# EAGLE design Octopus_USB_CAN_V1_1 (EAGLE 5.11)
FARNELL: 1712841; MF: AVX; MPN: 08055C104KAT2A; OC_FARNELL: 499687

## Sheet 1 of 2
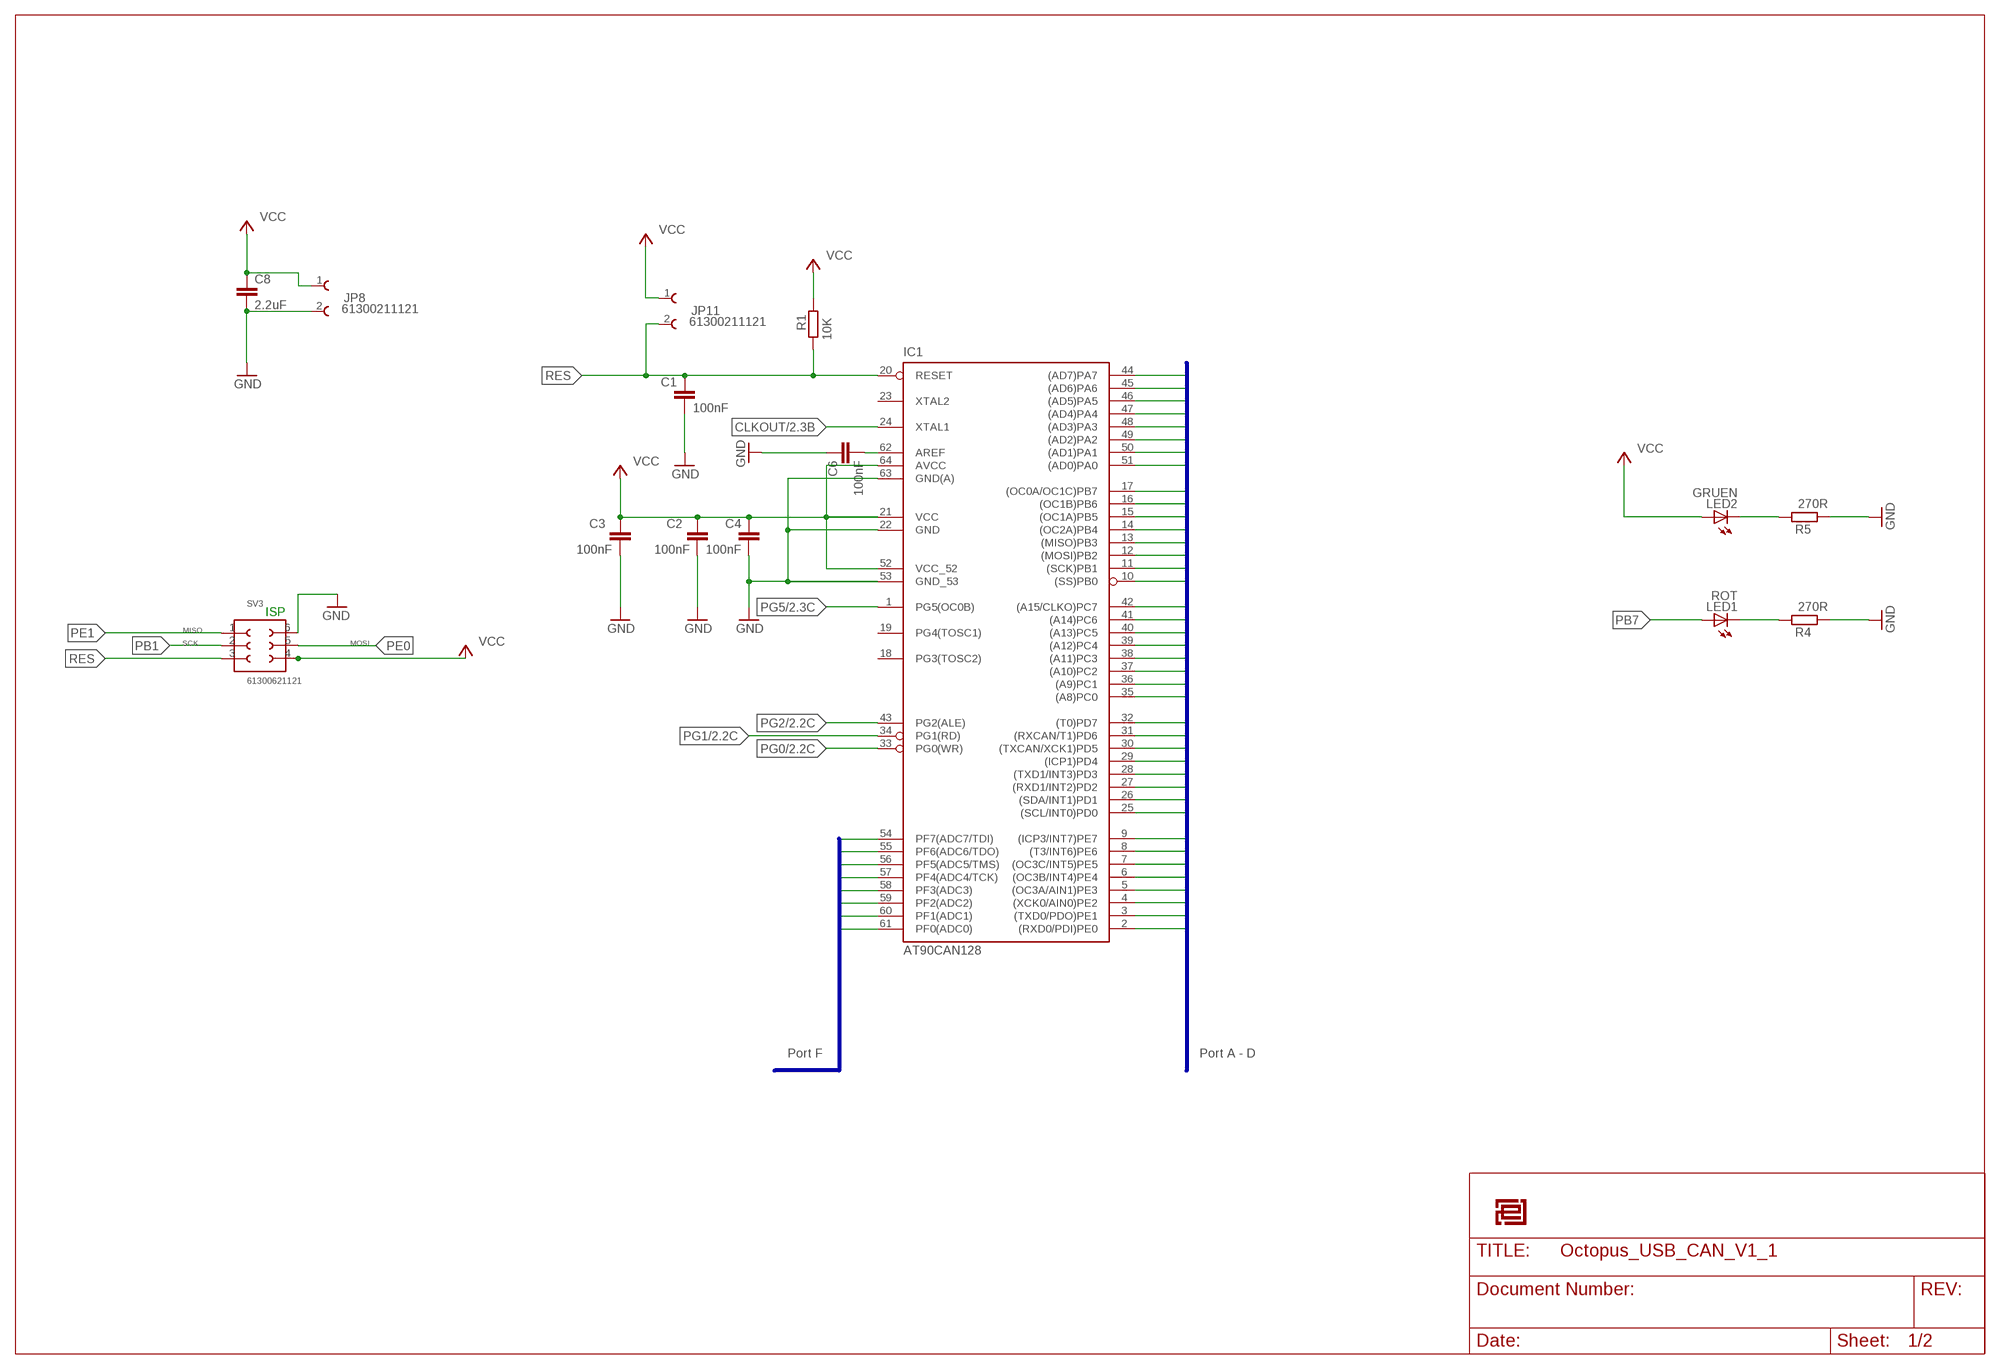
[diagram p0: schematic, sheet 1]

### Parts
C1  100nF  C-EUC0805  [C0805]
C2  100nF  C-EUC0805  [C0805]
C3  100nF  C-EUC0805  [C0805]
C4  100nF  C-EUC0805  [C0805]
C6  100nF  C-EUC0805  [C0805]
C8  2.2uF  C-EUC0805  [C0805]
IC1  AT90CAN128  [TQFP64]
JP8  61300211121  [61300211121]
JP11  61300211121  [61300211121]
LED1  ROT  LEDCHIP-LED0805  [CHIP-LED0805]
LED2  GRUEN  LEDCHIP-LED0805  [CHIP-LED0805]
R1  10K  R-EU_R0805  [R0805]
R4  270R  R-EU_R0805  [R0805]
R5  270R  R-EU_R0805  [R0805]
SV3  61300621121  [61300621121]
U$1  EPLOGO  [EPLOGOKUPFER]

### Nets
CLKOUT: IC1.24(XTAL1) ; also sheet 2
GND: C1.1 C2.2 C3.1 C4.1 C6.2 C8.2 IC1.22(GND) IC1.53(GND_53) IC1.63(GND(A)) JP8.2 R4.2 R5.2 SV3.6 ; also sheet 2
N$1: C6.1 IC1.62(AREF)
N$4: LED1.C R4.1
N$5: LED2.C R5.1
PA0: IC1.51((AD0)PA0) ; also sheet 2
PA1: IC1.50((AD1)PA1) ; also sheet 2
PA2: IC1.49((AD2)PA2) ; also sheet 2
PA3: IC1.48((AD3)PA3) ; also sheet 2
PA4: IC1.47((AD4)PA4) ; also sheet 2
PA5: IC1.46((AD5)PA5) ; also sheet 2
PA6: IC1.45((AD6)PA6) ; also sheet 2
PA7: IC1.44((AD7)PA7) ; also sheet 2
PB0: IC1.10((SS)PB0) ; also sheet 2
PB1: IC1.11((SCK)PB1) SV3.2 ; also sheet 2
PB2: IC1.12((MOSI)PB2) ; also sheet 2
PB3: IC1.13((MISO)PB3) ; also sheet 2
PB4: IC1.14((OC2A)PB4) ; also sheet 2
PB5: IC1.15((OC1A)PB5) ; also sheet 2
PB6: IC1.16((OC1B)PB6) ; also sheet 2
PB7: IC1.17((OC0A/OC1C)PB7) LED1.A ; also sheet 2
PC0: IC1.35((A8)PC0) ; also sheet 2
PC1: IC1.36((A9)PC1) ; also sheet 2
PC2: IC1.37((A10)PC2) ; also sheet 2
PC3: IC1.38((A11)PC3) ; also sheet 2
PC4: IC1.39((A12)PC4) ; also sheet 2
PC5: IC1.40((A13)PC5) ; also sheet 2
PC6: IC1.41((A14)PC6) ; also sheet 2
PC7: IC1.42((A15/CLKO)PC7) ; also sheet 2
PD0: IC1.25((SCL/INT0)PD0) ; also sheet 2
PD1: IC1.26((SDA/INT1)PD1) ; also sheet 2
PD2: IC1.27((RXD1/INT2)PD2) ; also sheet 2
PD3: IC1.28((TXD1/INT3)PD3) ; also sheet 2
PD4: IC1.29((ICP1)PD4) ; also sheet 2
PD5: IC1.30((TXCAN/XCK1)PD5) ; also sheet 2
PD6: IC1.31((RXCAN/T1)PD6) ; also sheet 2
PD7: IC1.32((T0)PD7) ; also sheet 2
PE0: IC1.2((RXD0/PDI)PE0) SV3.5 ; also sheet 2
PE1: IC1.3((TXD0/PDO)PE1) SV3.1 ; also sheet 2
PE2: IC1.4((XCK0/AIN0)PE2) ; also sheet 2
PE3: IC1.5((OC3A/AIN1)PE3) ; also sheet 2
PE4: IC1.6((OC3B/INT4)PE4) ; also sheet 2
PE5: IC1.7((OC3C/INT5)PE5) ; also sheet 2
PE6: IC1.8((T3/INT6)PE6) ; also sheet 2
PE7: IC1.9((ICP3/INT7)PE7) ; also sheet 2
PF0: IC1.61(PF0(ADC0)) ; also sheet 2
PF1: IC1.60(PF1(ADC1)) ; also sheet 2
PF2: IC1.59(PF2(ADC2)) ; also sheet 2
PF3: IC1.58(PF3(ADC3)) ; also sheet 2
PF4: IC1.57(PF4(ADC4/TCK)) ; also sheet 2
PF5: IC1.56(PF5(ADC5/TMS)) ; also sheet 2
PF6: IC1.55(PF6(ADC6/TDO)) ; also sheet 2
PF7: IC1.54(PF7(ADC7/TDI)) ; also sheet 2
PG0: IC1.33(PG0(WR)) ; also sheet 2
PG1: IC1.34(PG1(RD)) ; also sheet 2
PG2: IC1.43(PG2(ALE)) ; also sheet 2
PG5: IC1.1(PG5(OC0B)) ; also sheet 2
RES: C1.2 IC1.20(RESET) JP11.2 R1.2 SV3.3
VCC [500mA]: C2.1 C3.2 C4.2 C8.1 IC1.21(VCC) IC1.52(VCC_52) IC1.64(AVCC) JP8.1 JP11.1 LED2.A R1.1 SV3.4 ; also sheet 2
Unconnected: IC1.18(PG3(TOSC2)) IC1.19(PG4(TOSC1)) IC1.23(XTAL2)

### Buses
PF0,PF1,PF2,PF3,PF4,PF5,PF6,PF7
PA0,PA1,PA2,PA3,PA4,PA5,PA6,PA7,PB0,PB1,PB2,PB3,PB4,PB5,PB6,PB7,PC0,PC1,PC2,PC3,PC4,PC5,PC6,PC7,PD0,PD1,PD2,PD3,PD4,PD5,PD6,PD7,PE0,PE1,PE2,PE3,PE4,PE5,PE6,PE7

### Notes on the sheet
- ISP
- MISO
- SCK | MOSI
- Port F | Port A - D

## Sheet 2 of 2
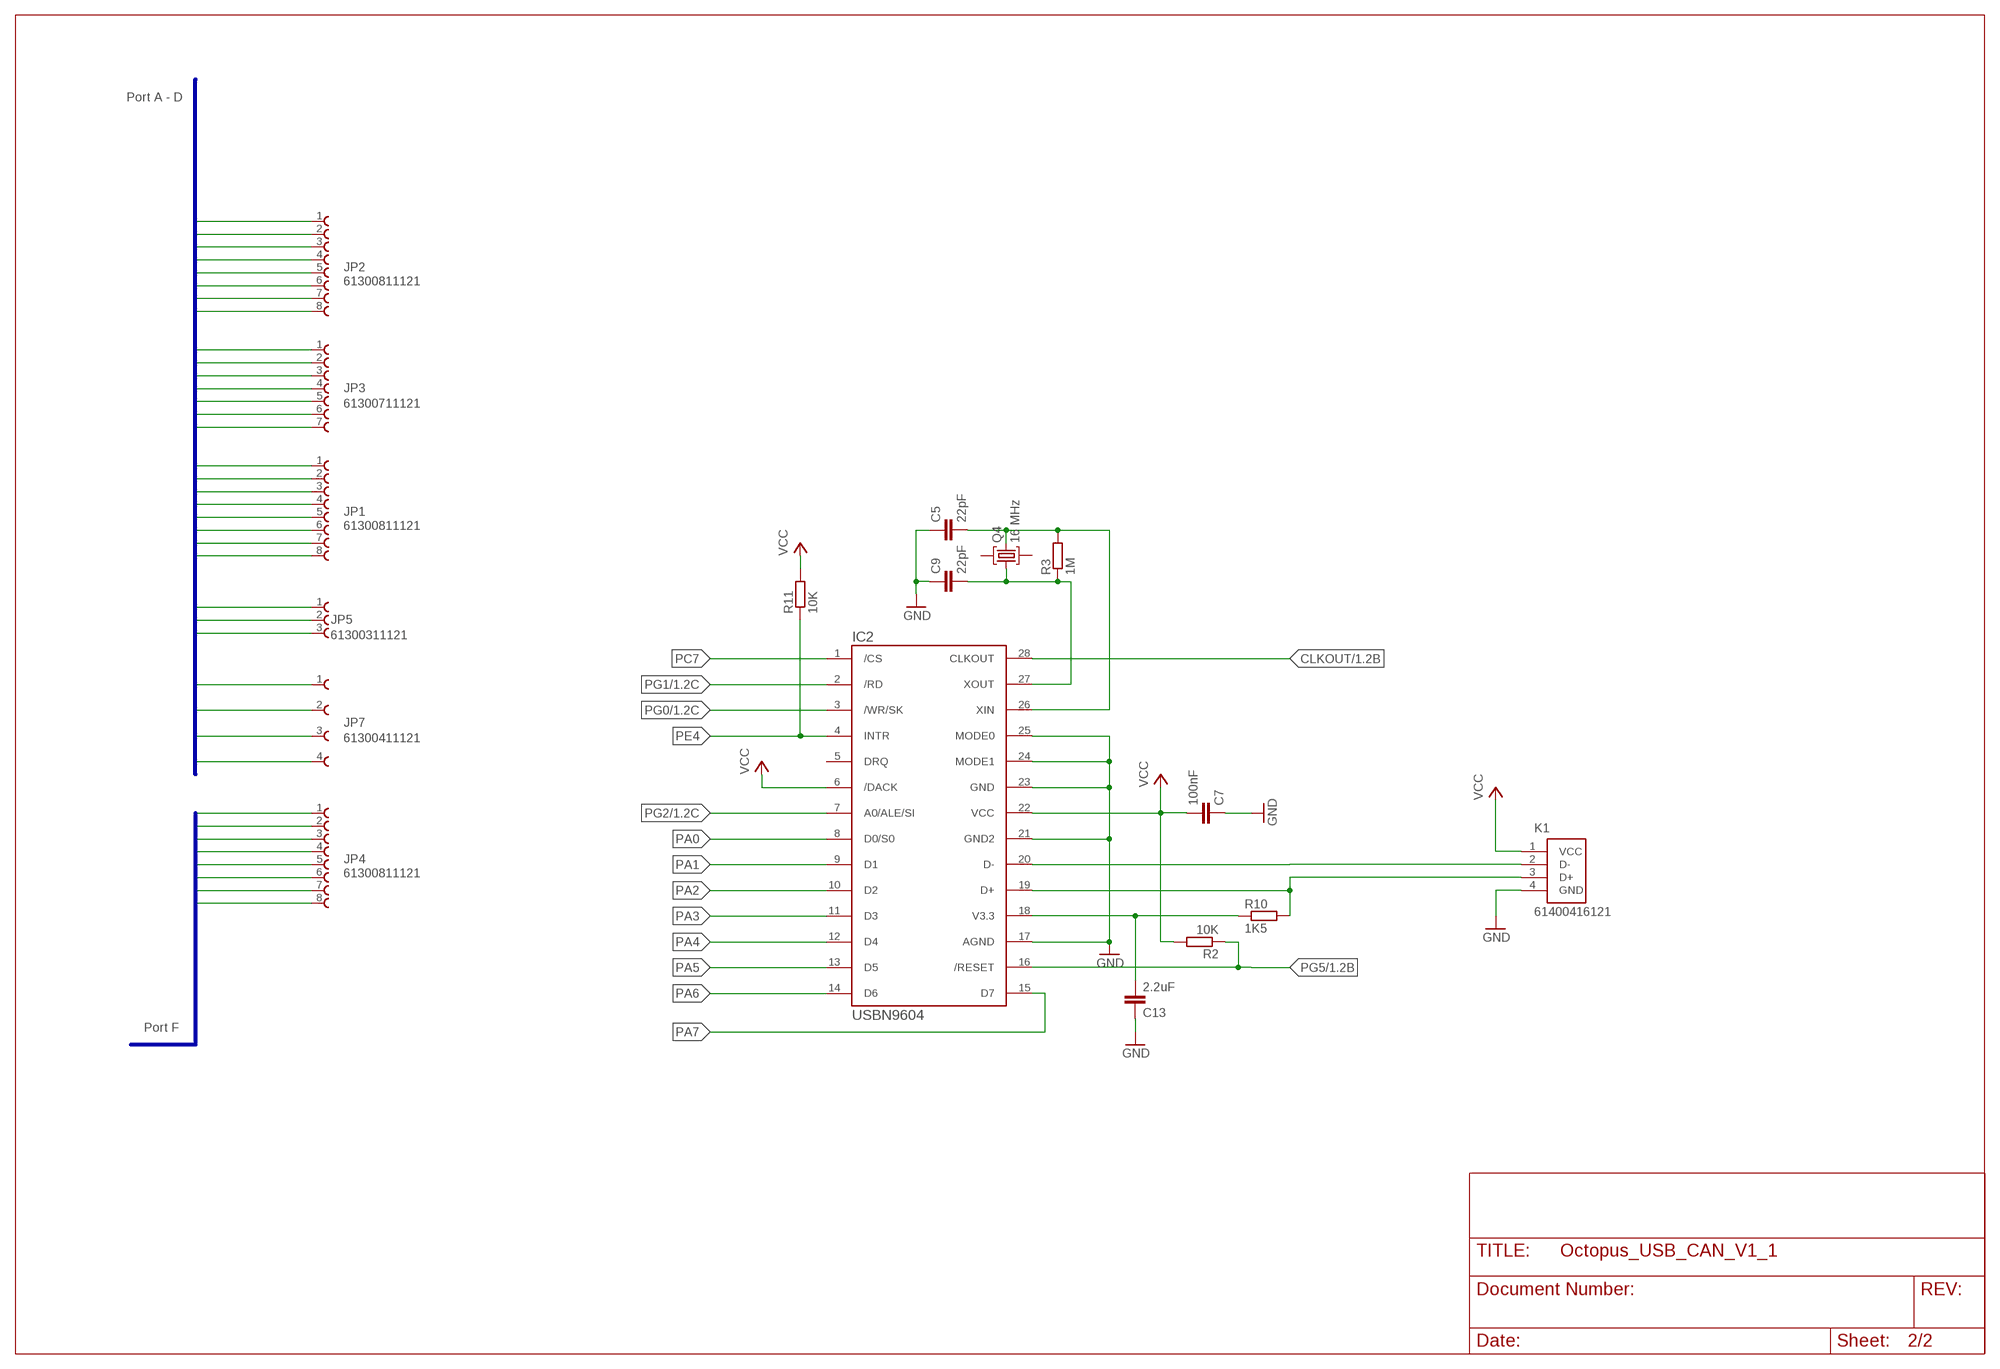
[diagram p1: schematic, sheet 2]

### Parts
C5  22pF  C-EUC0805  [C0805]
C7  100nF  C-EUC0805  [C0805]
C9  22pF  C-EUC0805  [C0805]
C13  2.2uF  C-EUC0805  [C0805]
IC2  USBN9604  [SO28-3]
JP1  61300811121  [61300811121]
JP2  61300811121  [61300811121]
JP3  61300711121  [61300711121]
JP4  61300811121  [61300811121]
JP5  61300311121  [61300311121]
JP7  61300411121  [61300411121]
K1  61400416121  [61400416121]
Q4  16 MHz  SX-32  [SX-32]
R2  10K  R-EU_R0805  [R0805]
R3  1M  R-EU_R0805  [R0805]
R10  1K5  R-EU_R0805  [R0805]
R11  10K  R-EU_R0805  [R0805]

### Nets
CLKOUT: IC2.28(CLKOUT) ; also sheet 1
D+: IC2.19(D+) K1.3(D+) R10.2
D-: IC2.20(D-) K1.2(D-)
GND: C5.1 C7.1 C9.1 C13.1 IC2.17(AGND) IC2.21(GND2) IC2.23(GND) IC2.24(MODE1) IC2.25(MODE0) K1.4(GND) ; also sheet 1
N$2: C9.2 IC2.27(XOUT) Q4.1 R3.1
N$3: C13.2 IC2.18(V3.3) R10.1
N$8: C5.2 IC2.26(XIN) Q4.3 R3.2
PA0: IC2.8(D0/S0) ; also sheet 1
PA1: IC2.9(D1) ; also sheet 1
PA2: IC2.10(D2) ; also sheet 1
PA3: IC2.11(D3) ; also sheet 1
PA4: IC2.12(D4) ; also sheet 1
PA5: IC2.13(D5) ; also sheet 1
PA6: IC2.14(D6) ; also sheet 1
PA7: IC2.15(D7) ; also sheet 1
PB0: JP2.8 ; also sheet 1
PB1: JP2.7 ; also sheet 1
PB2: JP2.6 ; also sheet 1
PB3: JP2.5 ; also sheet 1
PB4: JP2.4 ; also sheet 1
PB5: JP2.3 ; also sheet 1
PB6: JP2.2 ; also sheet 1
PB7: JP2.1 ; also sheet 1
PC0: JP3.7 ; also sheet 1
PC1: JP3.6 ; also sheet 1
PC2: JP3.5 ; also sheet 1
PC3: JP3.4 ; also sheet 1
PC4: JP3.3 ; also sheet 1
PC5: JP3.2 ; also sheet 1
PC6: JP3.1 ; also sheet 1
PC7: IC2.1(/CS) ; also sheet 1
PD0: JP1.8 ; also sheet 1
PD1: JP1.7 ; also sheet 1
PD2: JP1.6 ; also sheet 1
PD3: JP1.5 ; also sheet 1
PD4: JP1.4 ; also sheet 1
PD5: JP1.3 ; also sheet 1
PD6: JP1.2 ; also sheet 1
PD7: JP1.1 ; also sheet 1
PE0: JP7.4 ; also sheet 1
PE1: JP7.3 ; also sheet 1
PE2: JP7.2 ; also sheet 1
PE3: JP7.1 ; also sheet 1
PE4: IC2.4(INTR) R11.1 ; also sheet 1
PE5: JP5.3 ; also sheet 1
PE6: JP5.2 ; also sheet 1
PE7: JP5.1 ; also sheet 1
PF0: JP4.1 ; also sheet 1
PF1: JP4.2 ; also sheet 1
PF2: JP4.3 ; also sheet 1
PF3: JP4.4 ; also sheet 1
PF4: JP4.5 ; also sheet 1
PF5: JP4.6 ; also sheet 1
PF6: JP4.7 ; also sheet 1
PF7: JP4.8 ; also sheet 1
PG0: IC2.3(/WR/SK) ; also sheet 1
PG1: IC2.2(/RD) ; also sheet 1
PG2: IC2.7(A0/ALE/SI) ; also sheet 1
PG5: IC2.16(/RESET) R2.1 ; also sheet 1
VCC [500mA]: C7.2 IC2.6(/DACK) IC2.22(VCC) K1.1(VCC) R2.2 R11.2 ; also sheet 1
Unconnected: IC2.5(DRQ) Q4.2 Q4.4

### Buses
PA0,PA1,PA2,PA3,PA4,PA5,PA6,PA7,PB0,PB1,PB2,PB3,PB4,PB5,PB6,PB7,PC0,PC1,PC2,PC3,PC4,PC5,PC6,PC7,PD0,PD1,PD2,PD3,PD4,PD5,PD6,PD7,PE0,PE1,PE2,PE3,PE4,PE5,PE6,PE7
PF0,PF1,PF2,PF3,PF4,PF5,PF6,PF7

### Notes on the sheet
- Port A - D
- Port F

## Library data of the parts
C1-C6 C8 C9 = rcl:C-EU: CAPACITOR, European symbol
C7 C13 = resistor:C-EU: CAPACITOR, European symbol
IC1 = at90can128:AT90CAN128
IC2 = bene:USBN9604
JP1 JP2 JP4 = Wuerth_Elektronik_eiCan_01_Pin__Socked_Headers_v1_3:61300811121: WR-PHD 5.54mm Pin Header, 8 Pins
JP3 = Wuerth_Elektronik_eiCan_01_Pin__Socked_Headers_v1_3:61300711121: WR-PHD 2.54mm Pin Header, 7 Pins
JP5 = Wuerth_Elektronik_eiCan_01_Pin__Socked_Headers_v1_3:61300311121: WR-PHD 5.54mm Pin Header, 3 Pin
JP7 = Wuerth_Elektronik_eiCan_01_Pin__Socked_Headers_v1_3:61300411121: WR-PHD 2.54mm Pin Header, 4 Pin
JP8 JP11 = Wuerth_Elektronik_eiCan_01_Pin__Socked_Headers_v1_3:61300211121: WR-PHD 2.54mm Pin Header, 2 Pin
K1 = Wuerth_Elektronik_eiCan_11_Communication_Connectors_1_2:61400416121: WR-COM Horizontal USB Type B
LED1 LED2 = led:LED: LED OSRAM: - CHIPLED LG R971, LG N971, LY N971, LG Q971, LY Q971, LO R971, LY R971 LH N974, LH R974 LS Q976, LO Q976, LY Q976 LO Q996 - Hyper CHIPLED LW Q18S LB Q993, LB Q99A, LB R99A - SideLED LS A670, LO A670, LY A670, LG A670, LP A670 LB A673, LV A673, LT A673, LW A673 LH A674 LY A675 LS A676, LA A676, LO A676, LY A676, LW A676 LS A679, LY A679, LG A679 - Hyper Micro SIDELED® LS Y876, LA Y876, LO Y876, LY Y876 LT Y87S - SmartLED LW L88C, LW L88S LB L89C, LB L89S, LG L890 LS L89K, LO L89K, LY L89K LS L896, LA L896, LO L896, LY L896 - TOPLED LS T670, LO T670, LY T670, LG T670, LP T670 LSG T670, LSP T670, LSY T670, LOP T670, LYG T670 LG T671, LOG T671, LSG T671 LB T673, LV T673, LT T673, LW T673 LH T674 LS T676, LA T676, LO T676, LY T676, LB T676, LH T676, LSB T676, LW T676 LB T67C, LV T67C, LT T67C, LS T67K, LO T67K, LY T67K, LW E67C LS E67B, LA E67B, LO E67B, LY E67B, LB E67C, LV E67C, LT E67C LW T67C LS T679, LY T679, LG T679 LS T770, LO T770, LY T770, LG T770, LP T770 LB T773, LV T773, LT T773, LW T773 LH T774 LS E675, LA E675, LY E675, LS T675 LS T776, LA T776, LO T776, LY T776, LB T776 LHGB T686 LT T68C, LB T68C - Hyper Mini TOPLED® LB M676 - Mini TOPLED Santana® LG M470 LS M47K, LO M47K, LY M47K Source: http://www.osram.convergy.de LUXEON: - LUMILED® LXK2-PW12-R00, LXK2-PW12-S00, LXK2-PW14-U00, LXK2-PW14-V00 LXK2-PM12-R00, LXK2-PM12-S00, LXK2-PM14-U00 LXK2-PE12-Q00, LXK2-PE12-R00, LXK2-PE12-S00, LXK2-PE14-T00, LXK2-PE14-U00 LXK2-PB12-K00, LXK2-PB12-L00, LXK2-PB12-M00, LXK2-PB14-N00, LXK2-PB14-P00, LXK2-PB14-Q00 LXK2-PR12-L00, LXK2-PR12-M00, LXK2-PR14-Q00, LXK2-PR14-R00 LXK2-PD12-Q00, LXK2-PD12-R00, LXK2-PD12-S00 LXK2-PH12-R00, LXK2-PH12-S00 LXK2-PL12-P00, LXK2-PL12-Q00, LXK2-PL12-R00 Source: www.luxeon.com KINGBRIGHT: KA-3528ASYC Source: www.kingbright.com
Q4 = KUBUS3B_PARTS2:SX-32: SMD CRYSTAL
R1-R5 R10 R11 = rcl:R-EU_: RESISTOR, European symbol
SV3 = Wuerth_Elektronik_eiCan_01_Pin__Socked_Headers_v1_3:61300621121: WR-PHD 2.54mm Dual Pin Header, 6 Pins
U$1 = EmbeddedProjectsLogos2:EPLOGO

## Net classes
1 500mA: width 0.2 mm, drill 0.3 mm, clearance 0.2 mm

## Board
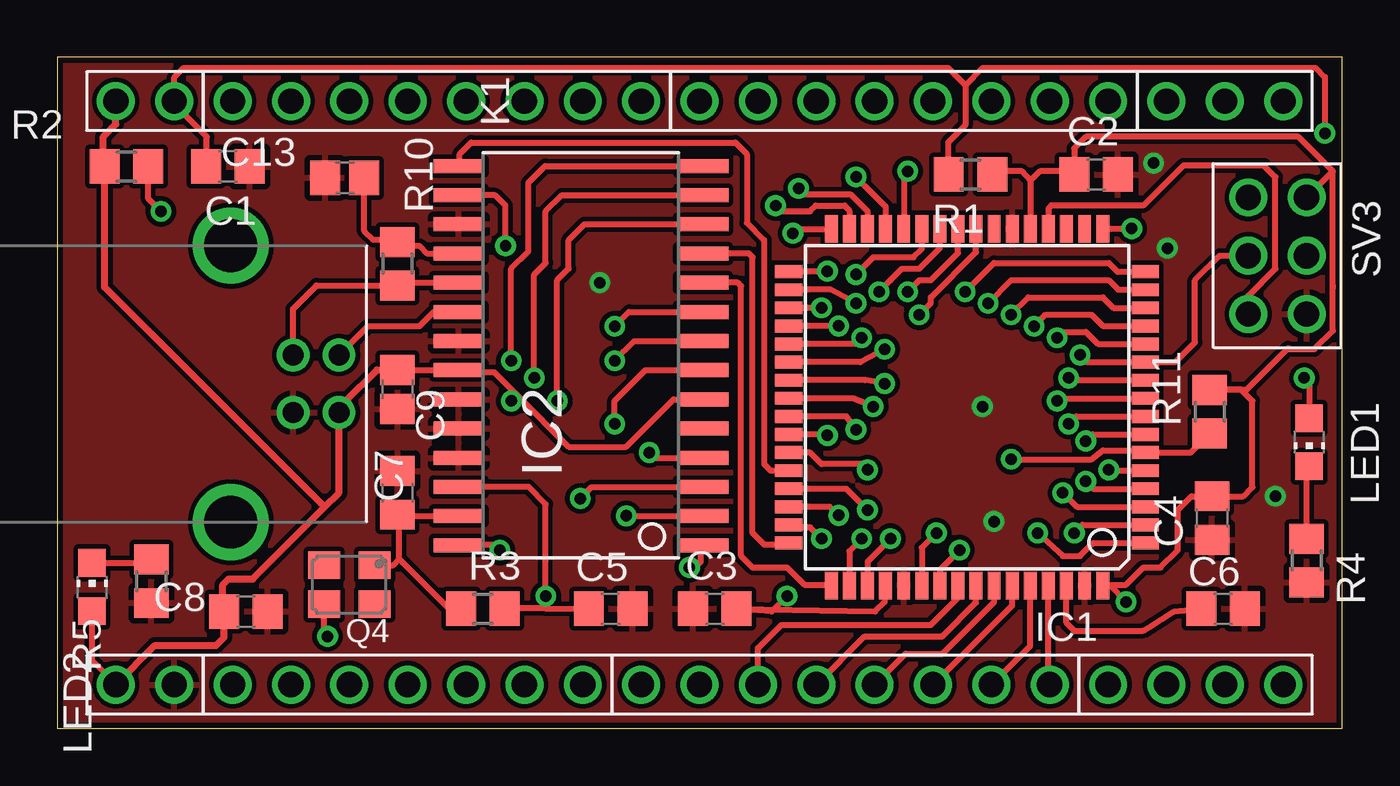
[diagram p2: board, top side]
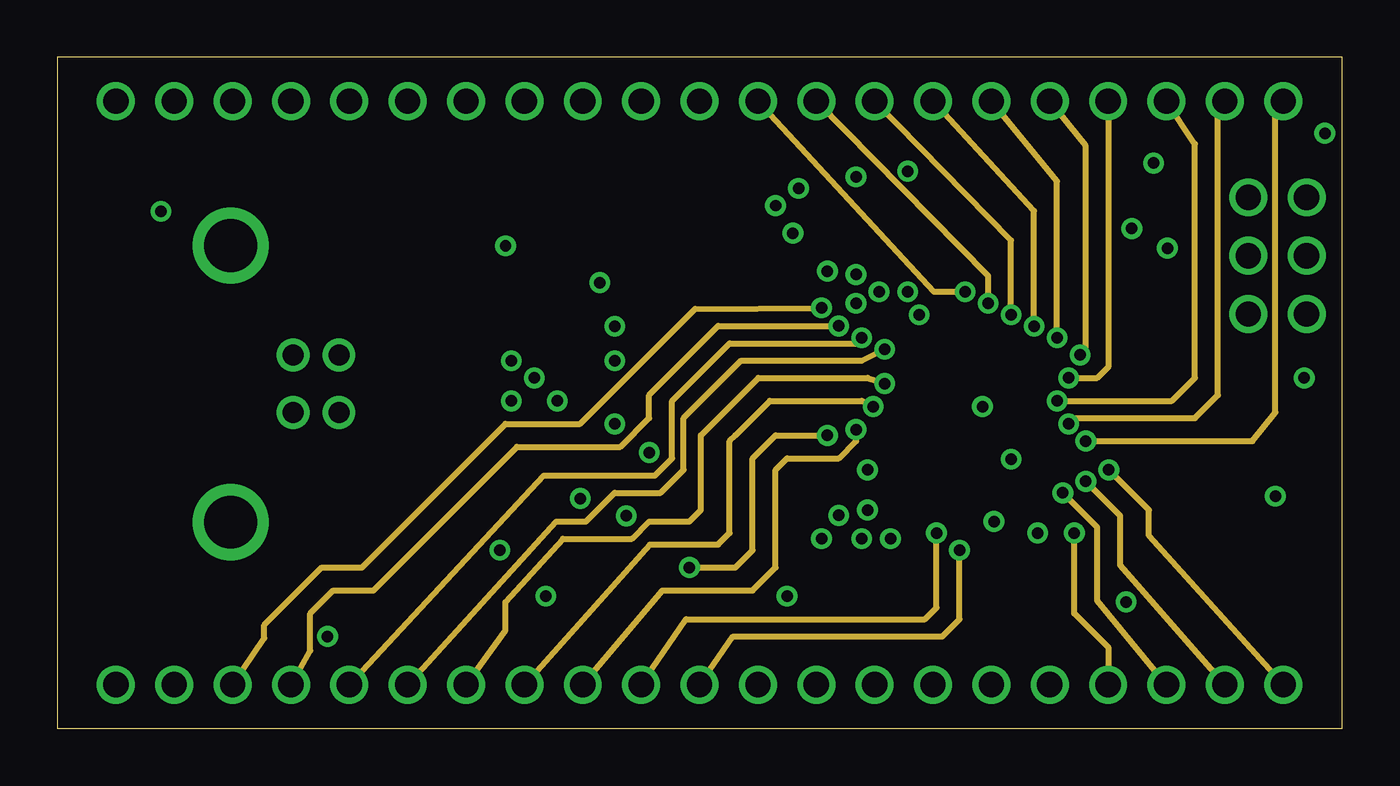
[diagram p3: board, inner layer Route2]
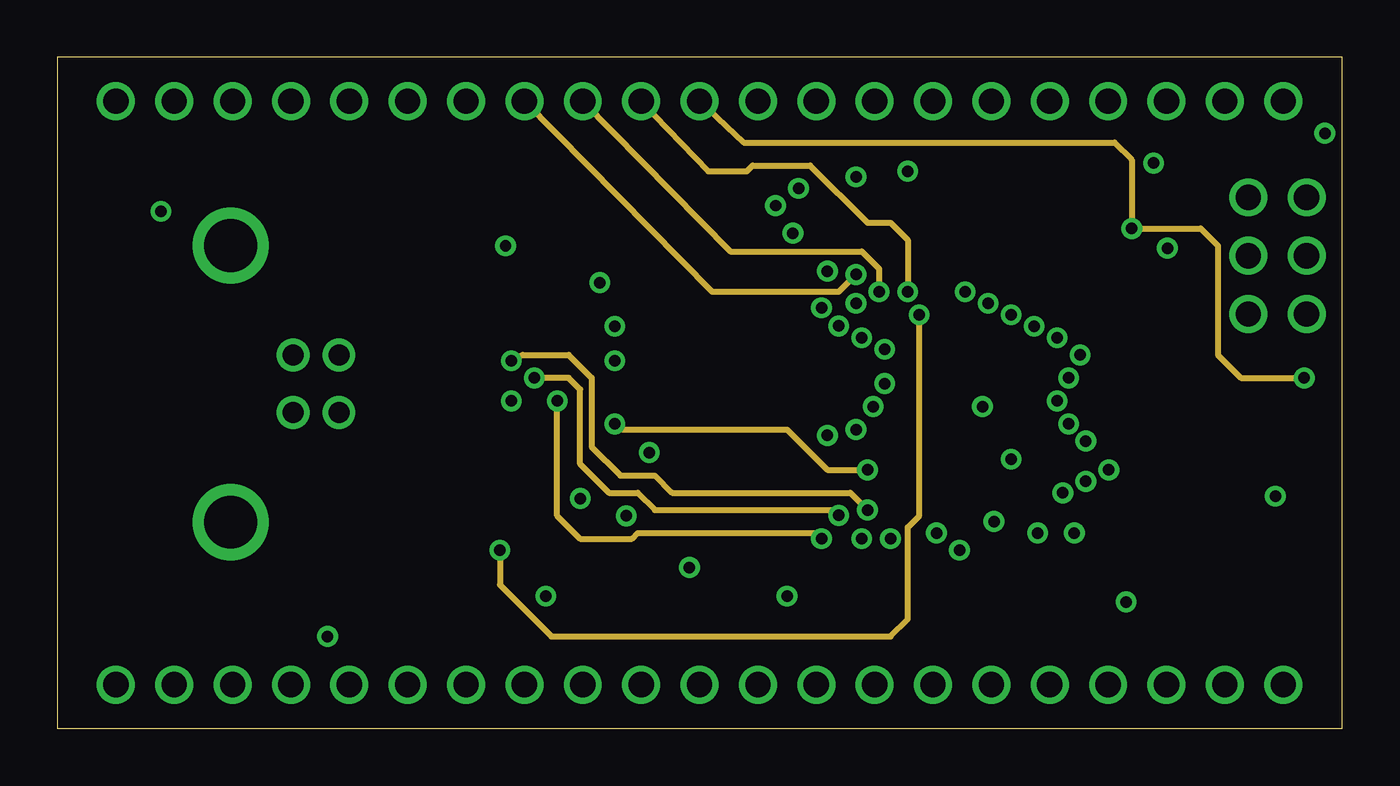
[diagram p4: board, inner layer Route3]
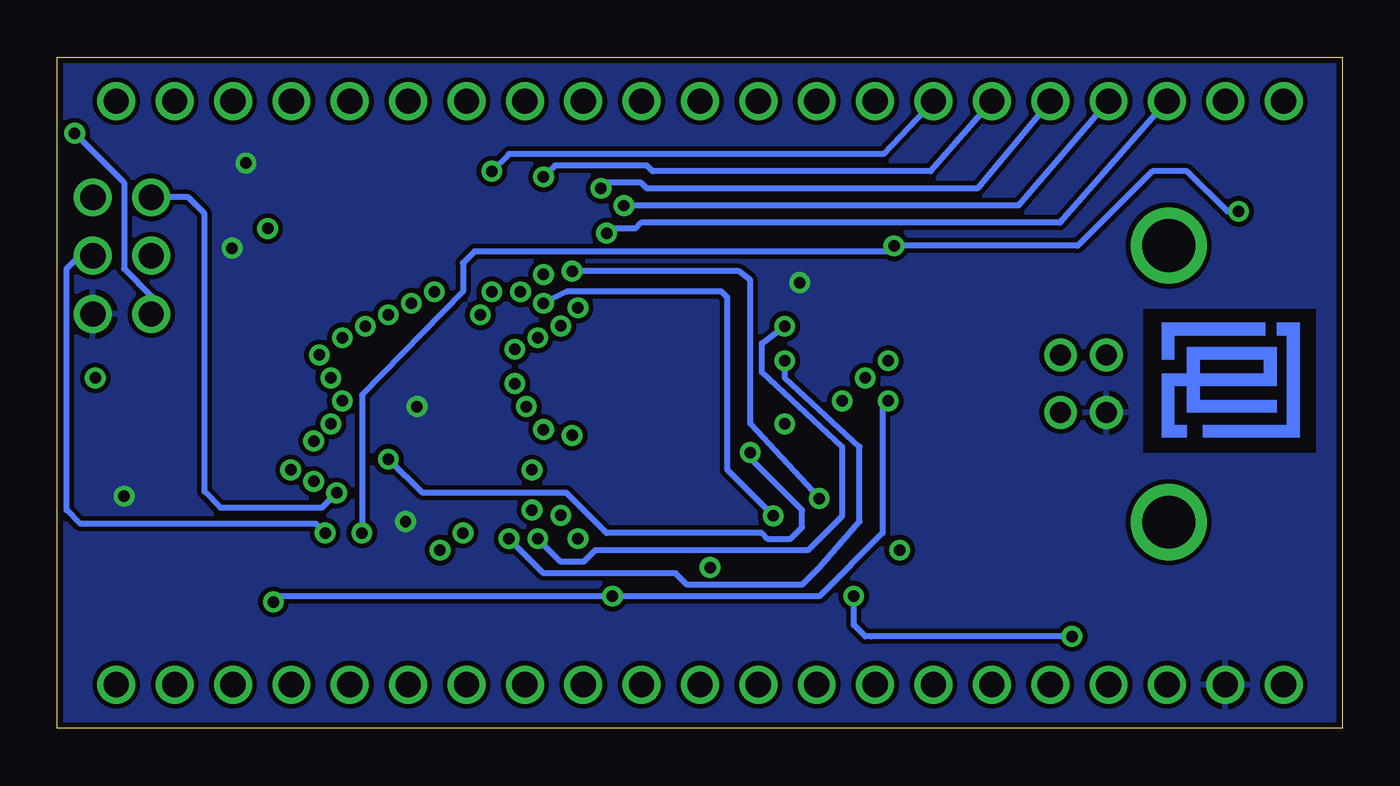
[diagram p5: board, bottom side, seen from below]

Size 55.9 x 29.2 mm. Coordinates in mm from the lower left corner, seen from the top.
Outline: 0,0 55.9,0 55.9,29.2 0,29.2 0,0
Copper layers (1*2+3*16): Top 0.035mm / dielectric 1.5mm / Route2 0.035mm / dielectric 0.15mm / Route3 0.035mm / dielectric 0.2mm / Bottom 0.035mm
Design rules "default *": minimum track width 10mil, minimum drill 24mil, track to track 8mil, track to pad 8mil, pad to pad 8mil, via to via 8mil, smd to smd 8mil, copper to edge 10mil, drill to drill 8mil, minimum pad ring 10mil, minimum via ring 8mil, stop-mask expansion 4mil, vias tented up to drill 0mil, thermal gap 10mil
bRestrict: area 1.2,12 to 8.7,18.2

### Footprints (pad centres in the part's own frame; a part is rotated, then mirrored left to right if it is on the bottom)
C0805 = smd 1.3 x 1.5: 1 -0.95,0; 2 0.95,0
C0805' = smd 1.3 x 1.5: 1 -0.85,0; 2 0.85,0
TQFP64 = smd 1.194 x 0.559: 1 -7.76,5.905; 2 -7.76,5.118; 3 -7.76,4.331; 4 -7.76,3.543; 5 -7.76,2.756; 6 -7.76,1.968; 7 -7.76,1.181; 8 -7.76,0.394; 9 -7.76,-0.394; 10 -7.76,-1.181; 11 -7.76,-1.968; 12 -7.76,-2.756; 13 -7.76,-3.543; 14 -7.76,-4.331; 15 -7.76,-5.118; 16 -7.76,-5.905; 33 7.76,-5.905; 34 7.76,-5.118; 35 7.76,-4.331; 36 7.76,-3.543; 37 7.76,-2.756; 38 7.76,-1.968; 39 7.76,-1.181; 40 7.76,-0.394; 41 7.76,0.394; 42 7.76,1.181; 43 7.76,1.968; 44 7.76,2.756; 45 7.76,3.543; 46 7.76,4.331; 47 7.76,5.118; 48 7.76,5.905 | smd 0.559 x 1.194: 17 -5.905,-7.76; 18 -5.118,-7.76; 19 -4.331,-7.76; 20 -3.543,-7.76; 21 -2.756,-7.76; 22 -1.968,-7.76; 23 -1.181,-7.76; 24 -0.394,-7.76; 25 0.394,-7.76; 26 1.181,-7.76; 27 1.968,-7.76; 28 2.756,-7.76; 29 3.543,-7.76; 30 4.331,-7.76; 31 5.118,-7.76; 32 5.905,-7.76; 49 5.905,7.76; 50 5.118,7.76; 51 4.331,7.76; 52 3.543,7.76; 53 2.756,7.76; 54 1.968,7.76; 55 1.181,7.76; 56 0.394,7.76; 57 -0.394,7.76; 58 -1.181,7.76; 59 -1.968,7.76; 60 -2.756,7.76; 61 -3.543,7.76; 62 -4.331,7.76; 63 -5.118,7.76; 64 -5.905,7.76
SO28-3 = smd 0.61 x 2.21: 1 -8.255,-5.315; 2 -6.985,-5.315; 3 -5.715,-5.315; 4 -4.445,-5.315; 5 -3.175,-5.315; 6 -1.905,-5.315; 7 -0.635,-5.315; 8 0.635,-5.315; 9 1.905,-5.315; 10 3.175,-5.315; 11 4.445,-5.315; 12 5.715,-5.315; 13 6.985,-5.315; 14 8.255,-5.315; 15 8.255,5.315; 16 6.985,5.315; 17 5.715,5.315; 18 4.445,5.315; 19 3.175,5.315; 20 1.905,5.315; 21 0.635,5.315; 22 -0.635,5.315; 23 -1.905,5.315; 24 -3.175,5.315; 25 -4.445,5.315; 26 -5.715,5.315; 27 -6.985,5.315; 28 -8.255,5.315
61300811121 = drill 1.1: 1 -8.89,0; 2 -6.35,0; 3 -3.81,0; 4 -1.27,0; 5 1.27,0; 6 3.81,0; 7 6.35,0; 8 8.89,0
61300711121 = drill 1.1: 1 -7.62,0; 2 -5.08,0; 3 -2.54,0; 4 0,0; 5 2.54,0; 6 5.08,0; 7 7.62,0
61300311121 = drill 1.1: 1 -2.54,0; 2 0,0; 3 2.54,0
61300411121 = drill 1.1: 1 -3.81,0; 2 -1.27,0; 3 1.27,0; 4 3.81,0
61300211121 = drill 1.1: 1 -1.27,0; 2 1.27,0
61400416121 = drill 0.92: 1 1.25,4.71; 2 -1.25,4.71; 3 -1.25,2.71; 4 1.25,2.71 | drill 2.3: Z1 -6.02,0; Z2 6.02,0
CHIP-LED0805 = smd 1.2 x 1.2: A 0,-1.05; C 0,1.05
SX-32 = smd 1.4 x 1.2: 1 -1.1,-0.85; 2 1.1,-0.85; 3 1.1,0.85; 4 -1.1,0.85
R0805 = smd 1.3 x 1.5: 1 -0.95,0; 2 0.95,0
61300621121 = drill 1.1: 1 0,2.54; 2 0,0; 3 0,-2.54; 4 2.54,2.54; 5 2.54,0; 6 2.54,-2.54

### Placement (x,y rotation side)
C1  7.42,24.45 180 top
C2  45.2,24.1 0 top
C3  28.6,5.2 0 top
C4  50.24,9.15 90 top
C5  24.07,5.2 180 top
C6  50.72,5.2 0 top
C7  100nF  [C0805']  14.8,14.75 90 top
C8  8.2,5.08 0 top
C9  14.8,10.25 270 top
C13  2.2uF  [C0805']  12.5,23.96 0 top
IC1  39.58,13.97 180 top
IC2  22.78,16.22 90 top
JP1  16.51,27.3 0 top
JP2  36.83,27.3 0 top
JP3  15.24,1.9 180 top
JP4  34.29,1.9 180 top
JP5  50.8,27.3 0 top
JP7  49.53,1.9 180 top
JP8  3.81,1.9 0 top
JP11  3.81,27.3 0 top
K1  7.54,14.99 270 top
LED1  54.47,12.45 180 top
LED2  1.51,6.15 0 top
Q4  12.7,6.25 180 top
R1  39.73,24.1 180 top
R2  3,24.45 180 top
R3  18.51,5.2 0 top
R4  54.36,7.3 270 top
R5  4.09,6.4 270 top
R10  14.8,20.22 270 top
R11  50.14,13.78 90 top
SV3  51.82,20.57 0 top
U$1  7.85,12.65 0 bottom

### Tracks (layer width: path | path; a pad name or v marks a point on that pad's centre or on a via)
CLKOUT  (via drill 0.5)
  Top 0.254: IC1.24 39.97,20.72 38,18.75 38,18.5 v37.5,18 | v19.25,7.75 19,8 17.5,8 IC2.28
  Route3 0.254: v37.5,18 37.5,9.25 37,8.75 37,4.75 36.25,4 21.5,4 19.25,6.25 v19.25,7.75
D+
  Top 0.254: IC2.19 14.93,19.39 R10.2 11.27,19.27 10.25,18.25 K1.3
D-
  Top 0.254: IC2.20 16.38,18.12 15.75,17.5 13.51,17.5 K1.2
GND  (via drill 0.5)
  other vias: 40.75,9 40.25,14 47.7,24.6 48.3,20.9 53,10.1 23.6,19.4
  pour Bottom: -0.25,29.5 -0.25,-0.25 56.25,-0.25 56.25,29.5
  pour Top: 0,29.5 0,-0.25 56.25,-0.25 56.25,29.5
N$1
  Top 0.254: C6.1 48.58,5.08 47.25,4.25 44.25,4.25 43.91,4.59 IC1.62
N$2
  Top 0.254: 14.87,9.23 IC2.27 | 14.87,9.23 C9.2 | 14.87,9.23 14.87,8.37 14.88,7.38 | R3.1 17.05,5.2 14.88,7.38 | Q4.1 14.6,7.1 14.88,7.38
N$3
  Top 0.254: IC2.18 16.09,20.66 15.75,21 14.97,21 R10.1 14.72,21.25 13.75,21.25 13.35,21.65 C13.2
N$4
  Top 0.254: R4.1 54.36,11.29 LED1.C
N$5
  Top 0.254: LED2.C 3.94,7.2 R5.1
N$8  (via drill 0.5)
  Top 0.254: 21.25,5.21 19.54,5.21 R3.2 | 21.25,5.21 C5.2 | Q4.3 11.6,4.15 v11.75,4 | 21.25,5.21 v21.25,5.75 21.25,9.75 20.5,10.51 IC2.26
  Bottom 0.254: v11.75,4 20.5,4 20.75,4 21.25,4.5 v21.25,5.75
PA0  (via drill 0.5)
  Top 0.254: IC1.51 35.25,7.25 35.75,7.75 v36.25,8.25 | IC2.8 25.11,16.86 v24.25,16
  Bottom 0.254: v24.25,16 24.25,15.25 21,12.25 21,9 22.75,7 23.5,6.25 28.5,6.25 29,6.75 32.5,6.75 34.75,6.75 v36.25,8.25
PA1  (via drill 0.5)
  Top 0.254: IC1.50 34.46,7.71 v35,8.25 | IC2.9 24.88,18.12 v24.25,17.5
  Bottom 0.254: v24.25,17.5 25.25,16.75 25.25,15.5 21.75,12.25 21.75,9.25 23.25,7.75 32.5,7.75 33,7.25 34,7.25 v35,8.25
PA2
  Top 0.254: IC2.10 29.61,19.39 29.75,19.25 29.75,7.5 30.25,7 31.75,7 32.5,6.25 33.63,6.25 IC1.49
PA3
  Top 0.254: IC2.11 30.09,20.66 30.25,20.5 30.25,8.5 30.75,8 31.76,8 IC1.48
PA4  (via drill 0.5)
  Top 0.254: IC2.12 22.93,21.93 22.25,21.25 22.25,20 21.75,19.5 v21.75,14.25 | v33.25,8.25 32.75,8.75 31.92,8.75 IC1.47
  Route3 0.254: v21.75,14.25 21.75,9.25 22.75,8.25 25,8.25 25.25,8.5 33,8.5 v33.25,8.25
PA5  (via drill 0.5)
  Top 0.254: IC2.13 21.95,23.2 21.25,22.5 21.25,20.25 20.75,19.75 20.75,15.5 v20.75,15.25 | IC1.46 33.61,9.64 v34,9.27
  Route3 0.254: v34,9.27 33.75,9.5 26,9.5 25.25,10.25 24,10.25 22.75,11.5 22.75,14.75 22.25,15.25 21.25,15.25 v20.75,15.25
PA6  (via drill 0.5)
  Top 0.254: IC2.14 21.23,24.48 20.5,23.75 20.5,20.75 19.75,20 19.75,16.25 v19.75,16 | IC1.45 34.32,10.43 v35.25,9.5
  Route3 0.254: v35.25,9.5 34.5,10.25 26.75,10.25 26,11 24.5,11 23.25,12.25 23.25,15.25 22.25,16.25 20.25,16.25 v19.75,16
PA7
  Top 0.254: IC1.44 31.04,11.21 30.75,11.5 30.75,21.25 30,22 30,25 29.5,25.5 18,25.5 17.5,25 17.5,24.51 IC2.15
PB0  (via drill 0.5)
  Top 0.254: IC1.10 44.1,15.15 v44,15.25
  Route2 0.254: v44,15.25 45.25,15.25 45.75,15.75 45.75,26.64 JP2.8
PB1  (via drill 0.5)
  Top 0.254: v44.5,16.25 44.81,15.94 IC1.11 48.64,15.94 49.5,16.8 49.5,19.5 50.57,20.57 SV3.2
  Route2 0.254: v44.5,16.25 44.75,16.5 44.75,25.35 JP2.7
PB2  (via drill 0.5)
  Top 0.254: IC1.12 45.27,16.73 44.75,17.25 43.75,17.25 v43.5,17
  Route2 0.254: v43.5,17 43.5,23.81 JP2.6
PB3  (via drill 0.5)
  Top 0.254: IC1.13 45.49,17.51 45,18 43,18 v42.5,17.5
  Route2 0.254: v42.5,17.5 42.5,22.52 JP2.5
PB4  (via drill 0.5)
  Top 0.254: IC1.14 45.95,18.3 45.5,18.75 42.25,18.75 v41.5,18
  Route2 0.254: v41.5,18 41.5,21.23 JP2.4
PB5  (via drill 0.5)
  Top 0.254: IC1.15 46.16,19.09 45.75,19.5 41.5,19.5 v40.5,18.5
  Route2 0.254: v40.5,18.5 40.5,19.69 JP2.3
PB6  (via drill 0.5)
  Top 0.254: IC1.16 46.12,19.88 45.75,20.25 40.75,20.25 v39.5,19
  Route2 0.254: v39.5,19 38.15,19 JP2.2
PB7  (via drill 0.5)
  Top 0.254: IC1.17 46.48,21.73 v46.75,21.75 | LED1.A 54.47,15.03 v54.25,15.25
  Route3 0.254: JP2.1 29.86,25.5 46,25.5 46.75,24.75 v46.75,21.75 49.75,21.75 50.5,21 50.5,16.25 51.5,15.25 v54.25,15.25
PC0  (via drill 0.5)
  Top 0.254: IC1.35 33.05,18.3 v33.25,18.3
  Route2 0.254: v33.25,18.3 27.75,18.25 22.75,13.25 19.5,13.25 13.25,7 11.5,7 9,4.5 9,3.92 JP3.7
PC1  (via drill 0.5)
  Top 0.254: IC1.36 33.99,17.51 v34,17.51
  Route2 0.254: v34,17.51 28.75,17.51 25.75,14.5 25.75,13.5 24.5,12.25 20,12.25 13.75,6 12,6 11,5 11,3.38 JP3.6
PC2  (via drill 0.5)
  Top 0.254: IC1.37 34.73,16.73 v35,17
  Route2 0.254: v35,17 34.75,16.75 29.25,16.75 26.75,14.25 26.75,11.75 26,11 21.16,11 JP3.5
PC3  (via drill 0.5)
  Top 0.254: IC1.38 34.94,15.94 v36,16.5
  Route2 0.254: v36,16.5 35,16 29.75,16 27.25,13.5 27.25,11.25 26.25,10.25 24.25,10.25 23,9 21.7,9 JP3.4
PC4  (via drill 0.5)
  Top 0.254: IC1.39 35.15,15.15 v36,15
  Route2 0.254: v36,15 35.25,15.25 30.5,15.25 28,12.75 28,9.5 27.5,9 25.75,9 25,8.25 22,8.25 19.5,5.5 19.5,4.26 JP3.3
PC5  (via drill 0.5)
  Top 0.254: IC1.40 34.61,14.36 v35.5,14
  Route2 0.254: v35.5,14 35,14.25 31,14.25 29.5,12.75 29.25,12.5 29.25,8.5 28.75,8 25.78,8 JP3.2
PC6  (via drill 0.5)
  Top 0.254: IC1.41 34.33,13.58 v34.75,13
  Route2 0.254: v34.75,13 34.75,12.5 34,11.75 31.75,11.75 31.25,11.25 31.25,7 30.25,6 26.32,6 JP3.1
PC7  (via drill 0.5)
  Top 0.254: IC1.42 33.46,12.79 v33.5,12.75 | v27.5,7 27.75,7 28,7.25 28,7.87 IC2.1
  Route2 0.254: v33.5,12.75 31.25,12.75 30.25,11.75 30.25,7.75 29.5,7 v27.5,7
PD0  (via drill 0.5)
  Top 0.254: IC1.25 39.19,20.69 38,19.5 37.5,19.5 v37,19
  Route3 0.254: v37,19 37,21.25 36.25,22 35.25,22 32.75,24.5 30.25,24.5 30,24.25 28.32,24.25 JP1.8
PD1  (via drill 0.5)
  Top 0.254: IC1.26 38.4,20.9 37.5,20 36.75,20 36.25,19.5 v35.75,19
  Route3 0.254: v35.75,19 35.75,20 35,20.75 29.28,20.75 JP1.7
PD2  (via drill 0.5)
  Top 0.254: IC1.27 37.61,20.86 37.25,20.5 36.25,20.5 35.5,20.5 v34.75,19.75
  Route3 0.254: JP1.6 28.49,19 34,19 v34.75,19.75
PD3  (via drill 0.5)
  Top 0.254: IC1.28 36.82,24.07 v37,24.25
  Bottom 0.254: v37,24.25 36.25,25 19.95,25 JP1.5
PD4  (via drill 0.5)
  Top 0.254: IC1.29 36.04,22.71 v34.75,24
  Bottom 0.254: v34.75,24 34.25,24.5 30.25,24.5 30,24.25 17.91,24.25 JP1.4
PD5  (via drill 0.5)
  Top 0.254: IC1.30 35.25,22.5 34.5,23.25 32.5,23.25 v32.25,23.5
  Bottom 0.254: v32.25,23.5 32,23.75 30.5,23.75 30.25,23.5 15.87,23.5 JP1.3
PD6  (via drill 0.5)
  Top 0.254: IC1.31 34.46,22.54 34.25,22.75 33,22.75 32.75,22.5 31.5,22.5 v31.25,22.75
  Bottom 0.254: v31.25,22.75 14.08,22.75 JP1.2
PD7  (via drill 0.5)
  Top 0.254: IC1.32 32.23,21.73 v32,21.55
  Bottom 0.254: v32,21.55 31.75,21.75 30.75,21.75 30.5,22 12.29,22 JP1.1
PE0  (via drill 0.5)
  Top 0.254: IC1.2 44.6,8.85 v44.25,8.5
  Route2 0.254: v44.25,8.5 44.25,5 45.75,3.5 45.75,2.57 JP7.4
  Bottom 0.254: SV3.5 54.93,20.57 55.5,20 55.5,9.5 54.9,8.9 44.65,8.9 v44.25,8.5
PE1  (via drill 0.5)
  Top 0.254: IC1.3 44.36,9.64 v43.75,10.25
  Route2 0.254: v43.75,10.25 45.25,8.75 45.25,5.55 JP7.3
  Bottom 0.254: SV3.1 50.21,23.11 49.5,22.4 49.5,10.3 48.8,9.6 44.4,9.6 v43.75,10.25
PE2  (via drill 0.5)
  Top 0.254: IC1.4 45.07,10.43 v44.75,10.75
  Route2 0.254: v44.75,10.75 46.25,9.25 46.25,7.09 JP7.2
PE3  (via drill 0.5)
  Top 0.254: IC1.5 45.79,11.21 v45.75,11.25
  Route2 0.254: v45.75,11.25 47.5,9.5 47.5,8.38 JP7.1
PE4  (via drill 0.5)
  Top 0.254: R11.1 49.31,12 IC1.6 47.34,12.1 45.5,12.1 45,11.71 v41.5,11.71 | IC2.4 25.98,11.78 v25.75,12
  Bottom 0.254: v25.75,12 25.75,11.75 23.5,9.5 23.5,8.75 24,8.25 25,8.25 25.25,8.5 32,8.5 33.75,10.25 40,10.25 v41.5,11.71
PE5  (via drill 0.5)
  Top 0.254: IC1.7 45.04,12.79 v44.75,12.5
  Route2 0.254: v44.75,12.5 52,12.5 53,13.75 53,26.83 JP5.3
PE6  (via drill 0.5)
  Top 0.254: IC1.8 44.33,13.58 v44,13.25
  Route2 0.254: v44,13.25 44.25,13.5 49.5,13.5 50.5,14.5 50.5,26.87 JP5.2
PE7  (via drill 0.5)
  Top 0.254: IC1.9 43.61,14.36 v43.5,14.25
  Route2 0.254: v43.5,14.25 48.5,14.25 49.5,15.25 49.5,25.43 JP5.1
PF0
  Top 0.254: IC1.61 43.12,2.1 JP4.1
PF1
  Top 0.254: IC1.60 42.34,3.6 JP4.2
PF2
  Top 0.254: IC1.59 41.55,5.35 JP4.3
PF3
  Top 0.254: IC1.58 40.76,5.51 38.5,3.25 36.91,3.25 JP4.4
PF4
  Top 0.254: IC1.57 39.97,5.47 38.5,4 35.12,4 JP4.5
PF5
  Top 0.254: JP4.6 30.48,3.48 31.5,4.5 36,4.5 38,4.5 38.75,5.25 39.19,5.69 IC1.56
PF6  (via drill 0.5)
  Top 0.254: IC1.55 38.4,6.9 v39.25,7.75
  Route2 0.254: v39.25,7.75 39.25,4.75 38.5,4 29.4,4 JP4.7
PF7  (via drill 0.5)
  Top 0.254: IC1.54 37.61,7.86 v38.25,8.5
  Route2 0.254: v38.25,8.5 38.25,5.25 37.75,4.75 27.36,4.75 JP4.8
PG0  (via drill 0.5)
  Top 0.254: IC1.33 33.38,19.88 v33.5,19.9 | v22.75,10 23.25,10.5 IC2.3
  Bottom 0.254: v33.5,19.9 26.25,19.9 25.75,19.5 25.75,13.25 v22.75,10
PG1  (via drill 0.5)
  Top 0.254: IC1.34 33.66,19.09 v34.75,18.5 | v24.75,9.25 28.08,9.25 IC2.2
  Bottom 0.254: v34.75,18.5 33.75,19 27,19 26.75,18.75 26.75,11.25 v24.75,9.25
PG2  (via drill 0.5)
  Top 0.254: IC1.43 32.75,12 33.25,11.5 35,11.5 v35.25,11.25 | v24.25,13.25 24.25,14.25 24.75,14.75 25.59,15.59 IC2.7
  Route3 0.254: v35.25,11.25 33.5,11.25 31.75,13 24.5,13 v24.25,13.25
PG5  (via drill 0.5)
  Top 0.254: IC2.16 19.05,23.2 19.5,22.75 v19.5,21 | IC1.1 45.06,8.06 45,8 44.5,7.5 43.75,7.5 v42.65,8.5 | R2.1 3.95,23.05 v4.5,22.5
  Bottom 0.254: v42.65,8.5 42.65,14.5 38.25,19 38.25,20.25 37.75,20.75 19.75,20.75 v19.5,21 11.5,21 8.25,24.25 6.75,24.25 5,22.5 v4.5,22.5
RES  (via drill 0.5)
  Top 0.254: 38.55,23.95 R1.2 38.75,23.98 38.75,25.5 39.5,26.25 39.5,28 | IC1.20 43.12,22.62 43.25,22.75 47.25,22.75 48.25,23.75 49,24.5 52.5,24.5 53,24 53,20 51.82,18.82 SV3.3 | v55.15,25.9 55.15,28.35 54.75,28.75 40.25,28.75 39.5,28 | 39.5,28 39,28.5 38.75,28.75 6.25,28.75 5.5,28.75 5.08,28.33 JP11.2 5.08,27.17 6.5,25.75 6.5,24.48 C1.2
  Bottom 0.254: SV3.3 51.82,18.82 53,20 53,23.75 v55.15,25.9
VCC  (via drill 0.5)
  Top 0.254: 51.62,14.62 52,14.25 52,10.5 51.6,10.1 C4.2 49.35,10.1 48.75,9.5 48.75,7.75 48,7 47.25,7 46.5,6.25 45.52,6.25 IC1.64 45.79,6.21 v46.5,5.5 | 51.62,14.62 51.5,14.75 50.16,14.75 R11.2 51.73,14.73 | 51.62,14.62 51.73,14.73 | 51.73,14.73 53.55,16.55 | 42.34,23.84 IC1.21 | 42.34,23.84 42.75,24.25 44.19,24.25 C2.1 44.25,25.25 44.75,25.75 54,25.75 55.5,24.25 | 42.34,23.84 41.97,24.25 40.78,24.25 R1.1 | IC2.6 26.82,14.31 24.75,12.25 22.25,12.25 20,14.5 | 20,14.5 19,15.5 17.55,15.5 IC2.22 14.81,15.59 C7.2 | IC1.52 36,6.17 36,5.5 35.58,5.08 C3.2 31.08,5.08 v31.75,5.75 | 20,14.5 v19.75,14.25 | 51.73,14.73 53.55,16.55 | 55.5,24.25 55.5,19.25 55.5,19.17 55.5,17.3 54.7,16.5 53.6,16.5 53.55,16.55 | C8.1 7.2,5.13 | LED2.A 1.51,2.93 JP8.1 | R2.2 2,24.5 | 55.5,24.25 SV3.4
  Top 0.305: 11.62,9.62 8.5,6.5 7.45,6.5 7.2,6.25 7.2,5.13 | 11.62,9.62 12.25,10.25 K1.1 12.25,13.95 12.55,14.25 13.9,15.6 C7.2 | C8.1 7.25,3.95 6.9,3.6 4.24,3.6 JP8.1 | JP11.1 2.54,26.29 2,25.75 2,24.5 | R2.2 2.05,19.2 11.62,9.62
  Bottom 0.254: v19.75,14.25 20,14 20,8.5 22.75,5.75 v31.75,5.75 32,5.75 46.25,5.75 v46.5,5.5